# EAGLE design ldr (EAGLE 7.2.0)
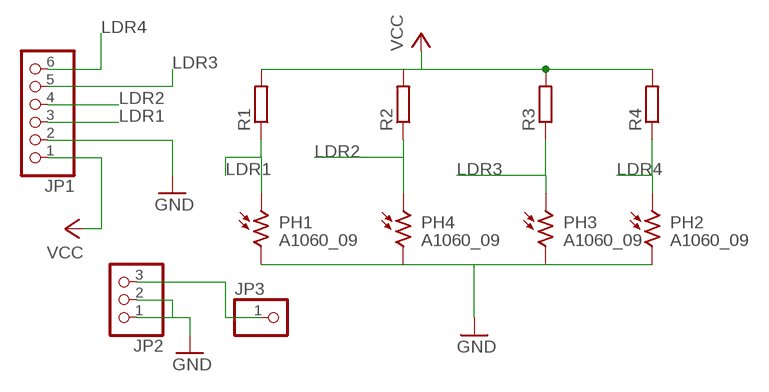
[diagram p0: schematic, sheet 1]

## Parts
JP1  PINHD-1X6CB  [1X06-CLEANBIG]
JP2  PINHD-1X3CB  [1X03-CLEANBIG]
JP3  PINHD-1X1CB  [1X01-CLEANBIG]
PH1  A1060_09  [T0-46-A10XX]
PH2  A1060_09  [T0-46-A10XX]
PH3  A1060_09  [T0-46-A10XX]
PH4  A1060_09  [T0-46-A10XX]
R1  R-EU_0207/10  [0207/10]
R2  R-EU_0207/10  [0207/10]
R3  R-EU_0207/10  [0207/10]
R4  R-EU_0207/10  [0207/10]

## Nets
GND: JP1.2 JP2.1 JP2.2 PH1.2 PH2.2 PH3.2 PH4.2
LDR1: JP1.3 PH1.1 R1.1
LDR2: JP1.4 PH4.1 R2.1
LDR3: JP1.5 PH3.1 R3.1
LDR4: JP1.6 PH2.1 R4.1
N$1: JP2.3 JP3.1
VCC: JP1.1 R1.2 R2.2 R3.2 R4.2

## Library data of the parts
JP1 = adafruit:PINHD-1X6: PIN HEADER
JP2 = adafruit:PINHD-1X3: PIN HEADER
JP3 = adafruit:PINHD-1X1: Pin header 1x1 for 0.1" spacing With round pins
PH1-PH4 = photo-elements:A10: Sensor Robust Light Sensing Applications Outdoor Light Sensing Application Source: http://optoelectronics.perkinelmer.com/content/Datasheets/DTS_PhotocellsA1050.pdf
R1-R4 = rcl:R-EU_: RESISTOR, European symbol

## Board
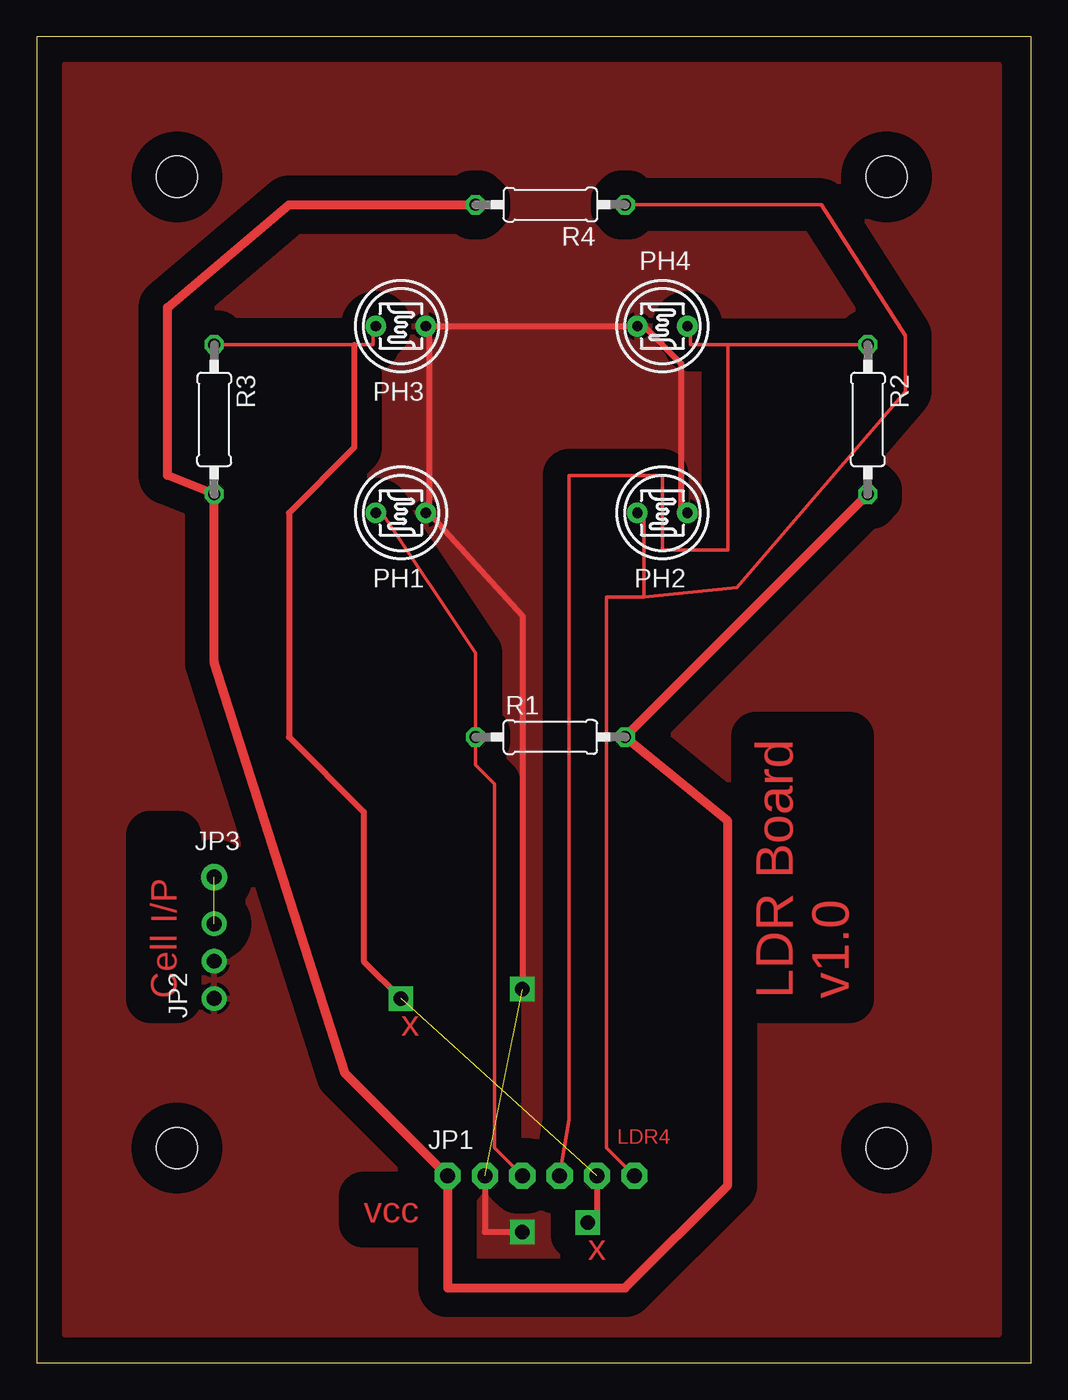
[diagram p1: board, top side]

Size 67.62 x 90.16 mm. Coordinates in mm from the lower left corner, seen from the top.
Outline: 0,0 67.62,0 67.62,90.16 0,90.16 0,0
Copper layers (1*16): Top 0.035mm / dielectric 1.5mm / Bottom 0.035mm
Design rules "default": minimum track width 10mil, minimum drill 24mil, track to track 8mil, track to pad 8mil, pad to pad 8mil, via to via 8mil, smd to smd 8mil, copper to edge 40mil, drill to drill 8mil, minimum pad ring 10mil, minimum via ring 8mil, stop-mask expansion 4mil, vias tented up to drill 0mil, thermal gap 10mil
Holes 2.8 mm at 9.53,14.61 57.79,14.61 9.53,80.64 57.79,80.64

### Footprints (pad centres in the part's own frame; a part is rotated, then mirrored left to right if it is on the bottom)
1X06-CLEANBIG = drill 1.016 pad 1.778 octagon: 1 -6.35,0; 2 -3.81,0; 3 -1.27,0; 4 1.27,0; 5 3.81,0; 6 6.35,0
1X03-CLEANBIG = drill 1.016 pad 1.676: 1 -2.54,0; 2 0,0; 3 2.54,0
1X01-CLEANBIG = drill 1.016 pad 1.778: 1 0,0
T0-46-A10XX = drill 0.7 pad 1.4: 1 -1.7,0; 2 1.7,0
0207/10 = drill 0.813 octagon: 1 -5.08,0; 2 5.08,0

### Placement (x,y rotation side)
JP1  34.29,12.7 0 top
JP2  12.07,27.3 90 top
JP3  12.07,33.02 0 top
PH1  24.77,57.78 0 top
PH2  42.55,57.78 0 top
PH3  24.77,70.48 0 top
PH4  42.55,70.48 180 top
R1  34.93,42.55 0 top
R2  56.52,64.14 270 top
R3  12.07,64.14 270 top
R4  34.93,78.74 180 top

### Tracks (layer width: path | path; a pad name or v marks a point on that pad's centre or on a via)
GND  (via drill 1 pad 1.68)  (1 unrouted)
  Top 0.254: 43.81,57.78 PH2.2 | 41.27,70.48 PH4.2 | 26.67,57.78 PH1.2 | 26.67,70.48 PH3.2
  Top 0.406: 43.81,57.78 43.81,67.95 41.27,70.48 | PH4.2 26.67,70.48 26.67,57.78 33.02,50.8 v33.02,25.4 | JP1.2 30.48,8.89 v33.02,8.89
  pour Top (isolate 1.676): 1.91,88.27 65.41,88.27 65.41,1.91 1.91,1.91
LDR1
  Top 0.254: PH1.1 23.49,57.78 29.84,48.26 R1.1 29.84,40.64 31.12,39.37 31.12,14.61 JP1.3
LDR2
  Top 0.254: 46.99,69.22 44.45,69.22 44.45,70.48 PH4.1 | 46.99,69.22 R2.1 | JP1.4 36.2,16.51 36.2,60.33 42.55,60.33 42.55,55.24 46.99,55.24 46.99,69.22
LDR3  (via drill 1 pad 1.68)  (1 unrouted)
  Top 0.254: R3.1 21.59,69.22 22.86,69.22 22.86,70.48 PH3.1
  Top 0.406: 21.59,69.22 21.59,62.23 17.15,57.78 17.15,42.55 22.23,37.47 22.23,27.3 v24.77,24.77 | JP1.5 38.1,10.16 v37.47,9.53
LDR4
  Top 0.254: R4.1 53.34,78.74 59.05,69.85 59.05,66.04 47.63,52.7 41.27,52.07 | 41.27,52.07 41.27,57.78 PH2.1 | JP1.6 38.73,14.61 38.73,52.07 41.27,52.07
N$1  (1 unrouted)
VCC
  Top 0.61: R2.2 R1.2 46.99,36.83 46.99,12.07 40.01,5.08 27.94,5.08 JP1.1 20.95,19.68 12.07,47.62 R3.2 8.89,60.33 8.89,71.75 17.15,78.74 R4.2

### Text on the board
Top: Cell I/P | LDR Board / v1.0 | x | LDR4 | vcc | x